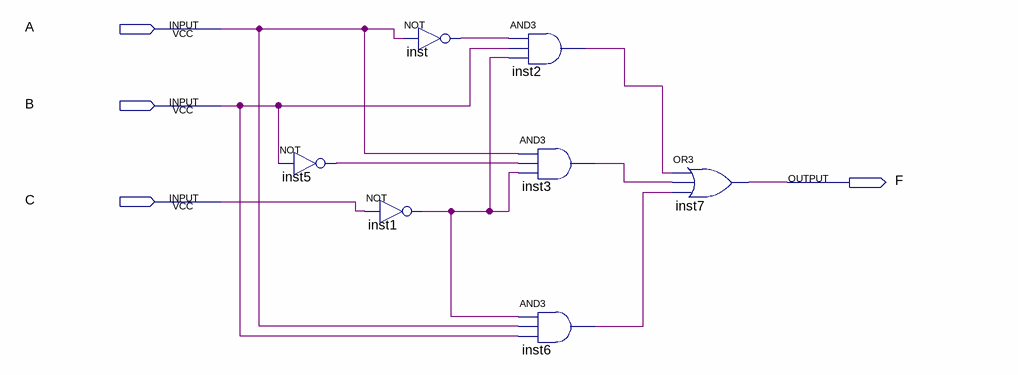
[diagram p0: schematic sheet]
// Quartus schematic lab2step1.bdf as structural Verilog: 7 symbols, 4 pins
module lab2step1 (
  input  A,
  input  B,
  input  C,
  output F
);

  wire inst1_out, inst2_out, inst3_out, inst5_out, inst6_out, inst_out;

  not inst5 (inst5_out, B);
  not inst (inst_out, A);
  not inst1 (inst1_out, C);
  and inst2 (inst2_out, inst_out, B, inst1_out);
  and inst3 (inst3_out, A, inst5_out, inst1_out);
  and inst6 (inst6_out, inst1_out, A, B);
  or inst7 (F, inst2_out, inst3_out, inst6_out);
endmodule
